# EasyEDA Pro project 酒精传感器实验.eprj

# Schematic Schematic1
Create Date: 2024-10-22; Page Name: P1; Project Name: 酒精传感器实验; Schematic Name: Schematic1; Update Date: 2024-10-22; Company: 嘉立创EDA; Page Size: A4; Version: V1.0
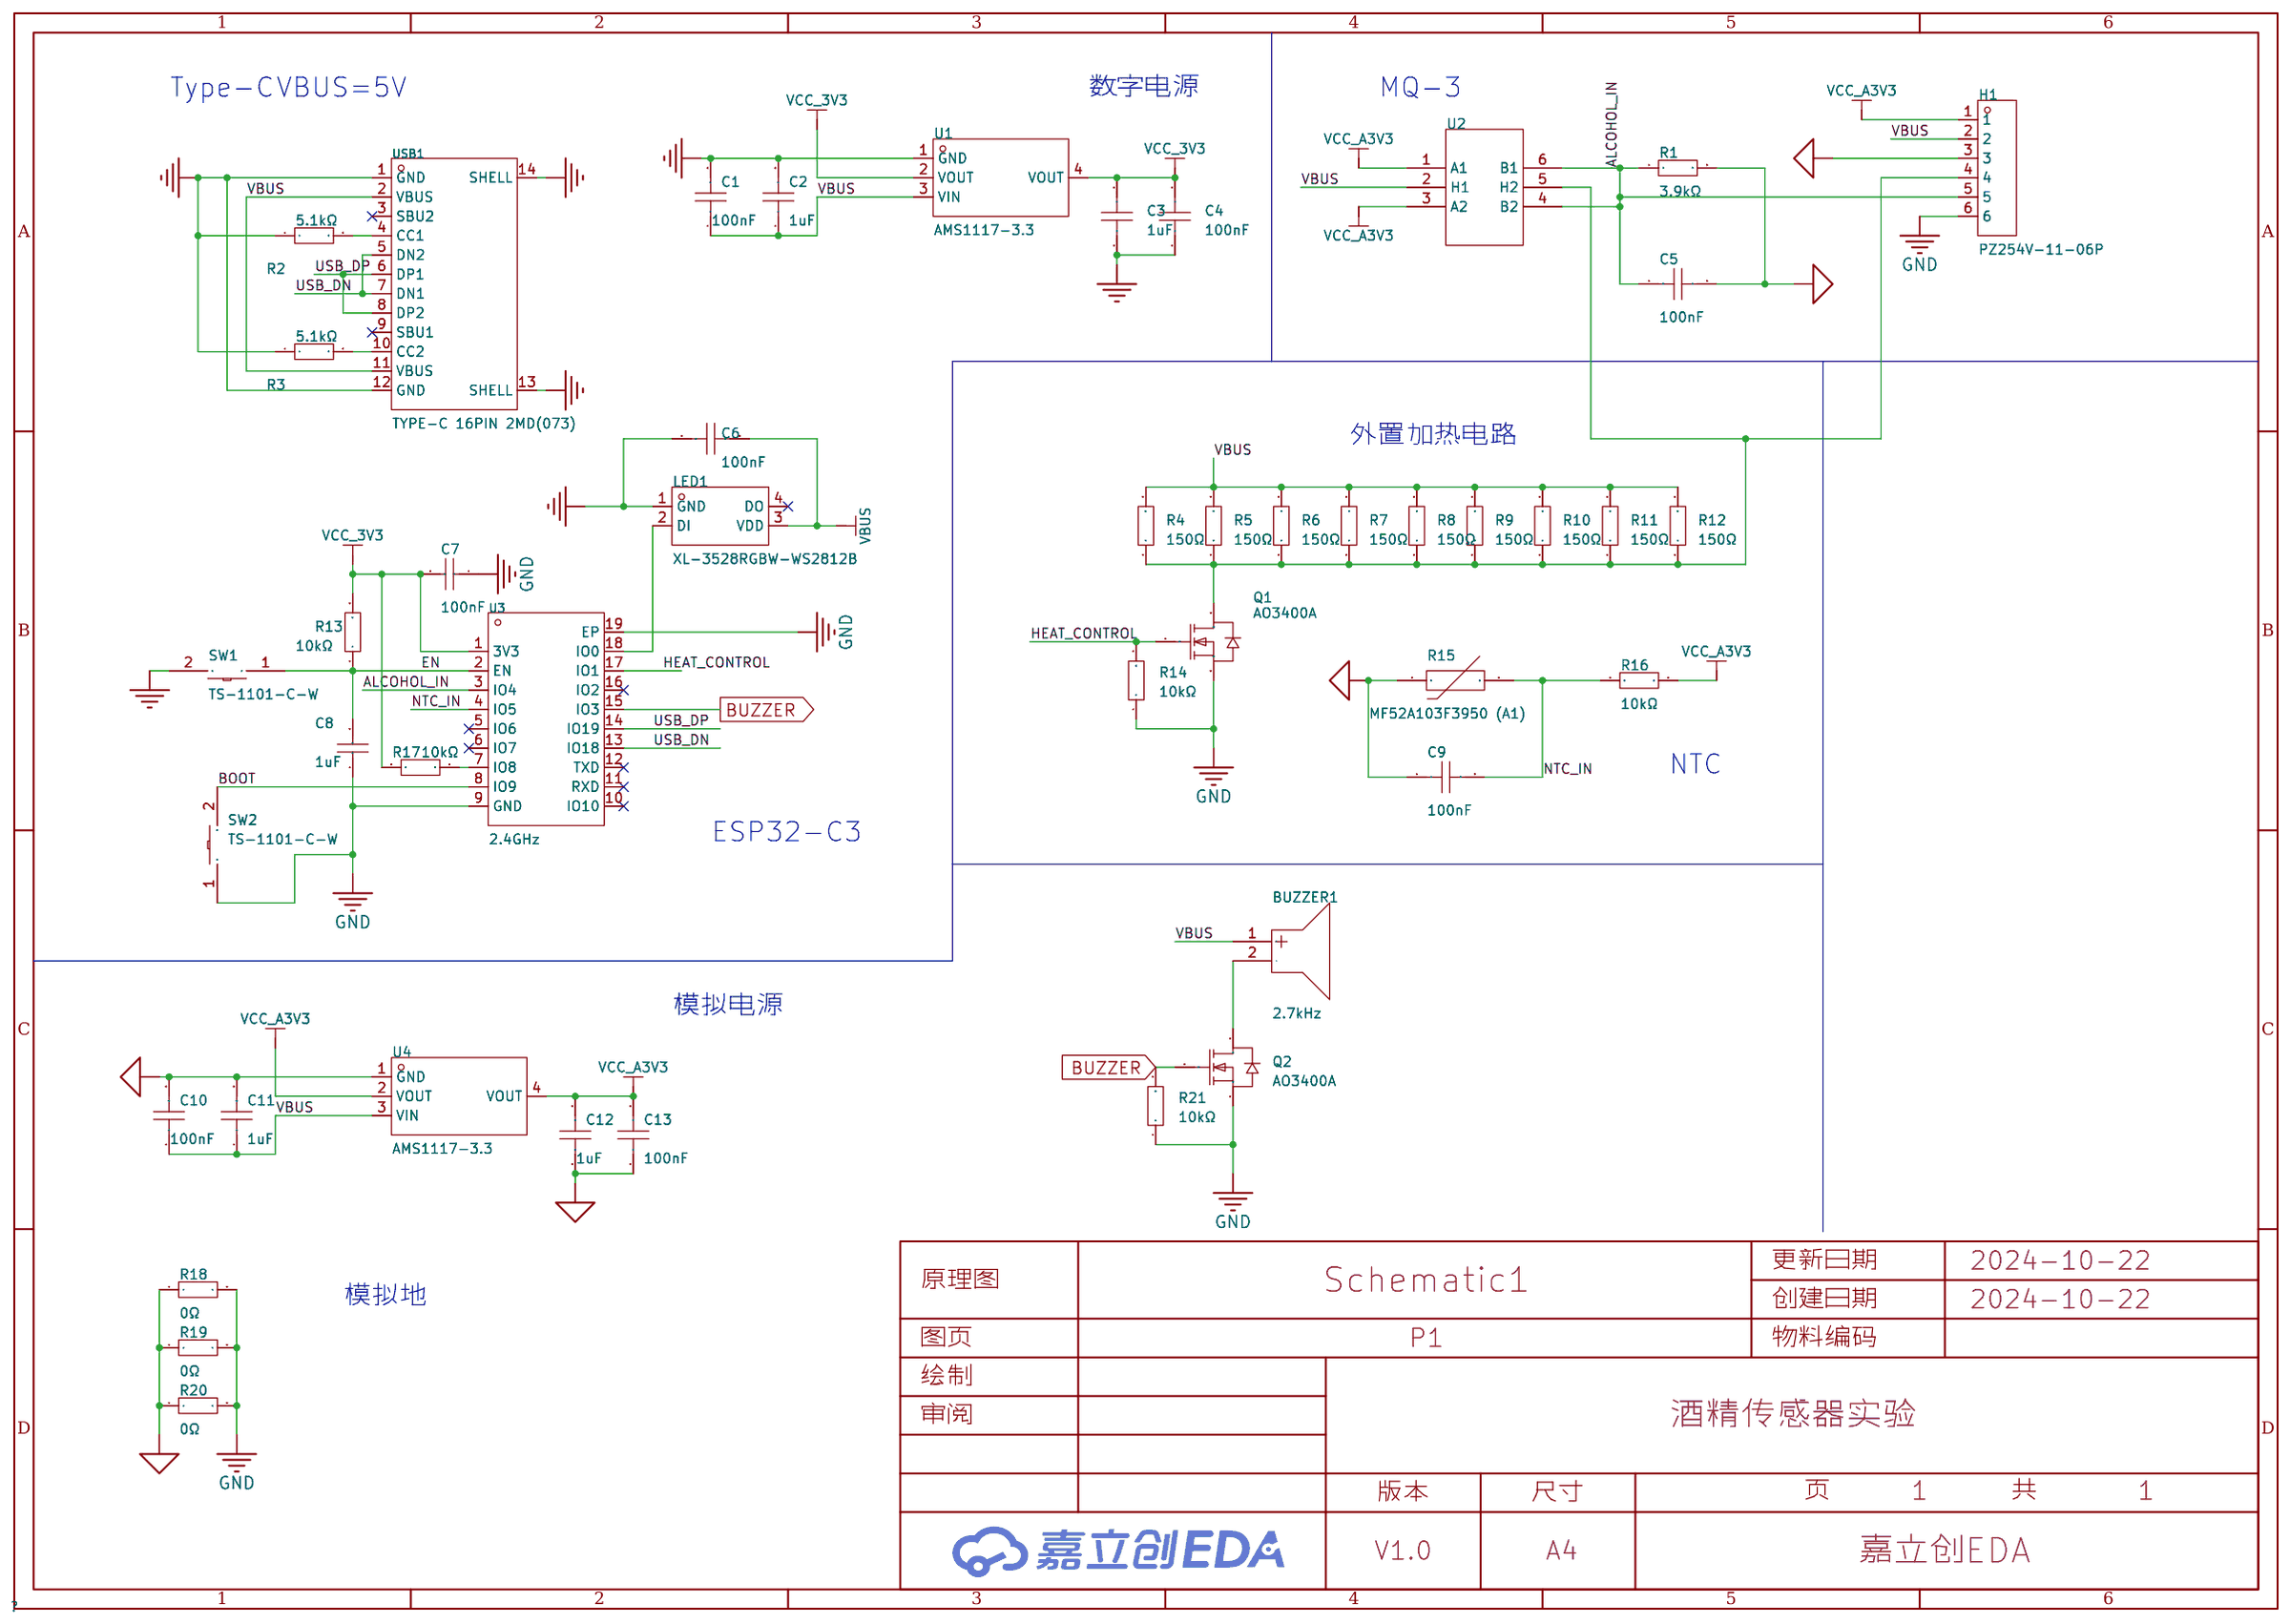
[diagram p0: schematic sheet]

## Parts
BUZZER1  2.7kHz  [BUZ-SMD_L9.6-W9.6-LS10.0-R]
C1  100nF  [C0603]
C2  1uF  [C0603]
C3  1uF  [C0603]
C4  100nF  [C0603]
C5  100nF  [C0603]
C6  100nF  [C0603]
C7  100nF  [C0603]
C8  1uF  [C0603]
C9  100nF  [C0603]
C10  100nF  [C0603]
C11  1uF  [C0603]
C12  1uF  [C0603]
C13  100nF  [C0603]
H1  PZ254V-11-06P  [HDR-TH_6P-P2.54-V-M]
LED1  XL-3528RGBW-WS2812B  [LED-SMD_4P-L3.5-W2.8-BR-1]
Q1  AO3400A  [SOT-23-3_L2.9-W1.3-P1.90-LS2.4-BR]
Q2  AO3400A  [SOT-23-3_L2.9-W1.3-P1.90-LS2.4-BR]
R1  3.9kΩ  [R0603]
R2  5.1kΩ  [R0603]
R3  5.1kΩ  [R0603]
R4  150Ω  [R0603]
R5  150Ω  [R0603]
R6  150Ω  [R0603]
R7  150Ω  [R0603]
R8  150Ω  [R0603]
R9  150Ω  [R0603]
R10  150Ω  [R0603]
R11  150Ω  [R0603]
R12  150Ω  [R0603]
R13  10kΩ  [R0603]
R14  10kΩ  [R0603]
R15  MF52A103F3950 (A1)  [RES-TH_L2.5-W2.5-P1.70-D0.3]
R16  10kΩ  [R0603]
R17  10kΩ  [R0603]
R18  0Ω  [R0603]
R19  0Ω  [R0603]
R20  0Ω  [R0603]
R21  10kΩ  [R0603]
SW1  TS-1101-C-W  [SW-SMD_L6.0-W3.3-LS8.0]
SW2  TS-1101-C-W  [SW-SMD_L6.0-W3.3-LS8.0]
U1  AMS1117-3.3  [SOT-223-3_L6.5-W3.4-P2.30-LS7.0-BR]
U2  -  [MQ-3-封装]
U3  2.4GHz  [BULETM-SMD_ESPRESSIF_ESP32-C3-WROOM-02-N4-4MB]
U4  AMS1117-3.3  [SOT-223-3_L6.5-W3.4-P2.30-LS7.0-BR]
USB1  TYPE-C 16PIN 2MD(073)  [USB-C-SMD_TYPE-C-6PIN-2MD-073]

## Library data of the parts
BUZZER1 = YS-SBZ9650DYB05: 驱动方式:有源(内含驱动线路);频率:2.7kHz;声压(SPL):80dB@5V,10cm;; LCSC Part Name: 贴片有源蜂鸣器5V; Supplier Part: C409830; Manufacturer: Fengming(锋鸣电子); Supplier Footprint: SMD,9.6x9.6mm; JLCPCB Part Class: 扩展库; Datasheet: https://atta.szlcsc.com/upload/public/pdf/source/20191217/C409830_8EC3C70066086F723D62F9967ED58A07.pdf; Supplier: LCSC; Oscillator Circuit: 有源(内含驱动线路); Operating Voltage: 3V~7V; Sound Pressure Level (SPL): 80dB@5V,10cm; Length: 9.6mm; Width: 9.6mm; Height: 5.3mm
C1 C4 C6 C7 C10 C13 = CC0603KRX7R9BB104: 容值:100nF;精度:±10%;额定电压:50V;材质(温度系数):X7R;; LCSC Part Name: 100nF ±10% 50V; Supplier Part: C14663; Manufacturer: YAGEO(国巨); Supplier Footprint: 0603; JLCPCB Part Class: Basic Part; Datasheet: https://atta.szlcsc.com/upload/public/pdf/source/20180910/C282072_33301C7F631E79921B82A8DAC6BCC5B3.pdf; Supplier: LCSC; Tolerance: ±10%; Voltage Rated: 50V; Temperature Coefficient: X7R
C2 C3 C11 C12 = CL10A105KB8NNNC: 容值:1uF;精度:±10%;额定电压:50V;材质(温度系数):X5R;; LCSC Part Name: 1uF ±10% 50V; Supplier Part: C15849; Manufacturer: SAMSUNG(三星); Supplier Footprint: 0603; JLCPCB Part Class: 基础库; Datasheet: https://atta.szlcsc.com/upload/public/pdf/source/20160218/1457707763339.pdf; Supplier: LCSC; Tolerance: ±10%; Voltage Rated: 50V; Temperature Coefficient: X5R
C5 C9 = CGA0603X7R104K500JT: 容值:100nF;精度:±10%;额定电压:50V;材质(温度系数):X7R;; LCSC Part Name: 100nF ±10% 50V; Supplier Part: C6119867; Manufacturer: HRE(芯声); Supplier Footprint: 0603; JLCPCB Part Class: 扩展库; Supplier: LCSC; Tolerance: ±10%; Voltage Rated: 50V; Temperature Coefficient: X7R
C8 = CL10A105KA8NNNC: 容值:1uF;精度:±10%;额定电压:25V;温度系数:X5R;; LCSC Part Name: 1uF±10%25V; Supplier Part: C5673; Manufacturer: SAMSUNG(三星); Supplier Footprint: 0603; JLCPCB Part Class: ExtendedPart; Datasheet: https://atta.szlcsc.com/upload/public/pdf/source/20160103/1457707739994.pdf; Supplier: LCSC; Tolerance: ±10%; Voltage Rated: 25V; Temperature Coefficient: X5R
H1 = PZ254V-11-06P: 插针结构:1x6P;间距:2.54mm;行距:-;圆针/方针:方针;安装类型:直插;排数:单排;总PIN位数:6P;额定电流:-;额定电压:-;配合针长度:6mm;塑高:2.5mm;端接针长度:3mm;触头材质:黄铜;触头镀层:-;工作温度范围:-40℃~+105℃;颜色:黑色;; LCSC Part Name: 间距:2.54mm 1x6P 直插 方针; Supplier Part: C492405; Manufacturer: XFCN(兴飞); Supplier Footprint: 插件,P=2.54mm; JLCPCB Part Class: 扩展库; Datasheet: https://atta.szlcsc.com/upload/public/pdf/source/20200309/C492405_597F1930F5B55CC3C7FD95458F1C3977.pdf; Supplier: LCSC; Pin Structure: 1x6P; Pitch: 2.54mm; Circluar Pins/Square Pins: 方针; Mounting Type: 直插; Number of Rows: 单排; Number of Pins: 6P; Length of Mating Pin: 6mm; Insulation Height: 2.5mm; Length of End Connection Pin: 3mm; Contact Material: 黄铜; Operating Temperature Range: -40℃~+105℃; Color: 黑色
LED1 = XL-3528RGBW-WS2812B: 3528 七彩幻彩雾状 ws2812B 内置驱动IC; Supplier Part: C2890364; Manufacturer: XINGLIGHT(成兴光); Supplier Footprint: SMD3528-4P; JLCPCB Part Class: 扩展库; Datasheet: https://atta.szlcsc.com/upload/public/pdf/source/20240218/041E1E0D0024617DFFF124D9C311BB4D.pdf; Supplier: LCSC
Q1 Q2 = AO3400A_C20917: 类型:1个N沟道;漏源电压(Vdss):30V;连续漏极电流(Id):5.7A;功率(Pd):1.4W;导通电阻(RDS(on)@Vgs,Id):26.5mΩ@10V,5.7A;阈值电压(Vgs(th)@Id):1.5V@250uA;; LCSC Part Name: 1个N沟道 耐压:30V 电流:5.7A; Supplier Part: C20917; Manufacturer: AOS; Supplier Footprint: SOT-23-3L; JLCPCB Part Class: 基础库; Datasheet: https://atta.szlcsc.com/upload/public/pdf/source/20140107/1457706668533.pdf; Supplier: LCSC; Type: 1个N沟道; Drain Source Voltage (Vdss): 30V; Continuous Drain Current (Id): 5.7A; Power Dissipation (Pd): 1.4W; Drain Source On Resistance (RDS(on)@Vgs,Id): 26.5mΩ@10V,5.7A; Gate Threshold Voltage (Vgs(th)@Id): 1.5V@250uA; Total Gate Charge (Qg@Vgs): 7nC@4.5V; Input Capacitance (Ciss@Vds): 630pF@15V; Operating Temperature: -55℃~+150℃@(Tj)
R1 = 0603WAF3901T5E: 电阻类型:厚膜电阻;阻值:3.9kΩ;精度:±1%;功率:100mW;最大工作电压:75V;温度系数:±100ppm/℃;; LCSC Part Name: 3.9kΩ ±1% 100mW 厚膜电阻; Supplier Part: C23018; Manufacturer: UNI-ROYAL(厚声); Supplier Footprint: 0603; JLCPCB Part Class: 基础库; Datasheet: https://atta.szlcsc.com/upload/public/pdf/source/20200306/C422600_1E6D84923E4A46A82E41ADD87F860B5C.pdf; Supplier: LCSC; Type: 厚膜电阻; Tolerance: ±1%; Power(Watts): 100mW; Overload Voltage (Max): 75V; Temperature Coefficient: ±100ppm/℃; Operating Temperature Range: -55℃~+155℃
R2 R3 = 0603WAF5101T5E: 电阻类型:厚膜电阻;阻值:5.1kΩ;精度:±1%;功率:100mW;; LCSC Part Name: 5.1kΩ ±1% 100mW; Supplier Part: C23186; Manufacturer: UNI-ROYAL(厚声); Supplier Footprint: 0603; JLCPCB Part Class: Basic Part; Datasheet: https://atta.szlcsc.com/upload/public/pdf/source/20200306/C422600_1E6D84923E4A46A82E41ADD87F860B5C.pdf; Supplier: LCSC; Type: 厚膜电阻; Tolerance: ±1%; Power(Watts): 100mW; Temperature Coefficient: ±100ppm/℃; Overload Voltage (Max): 75V; Operating Temperature Range: -55℃~+155℃
R4-R12 = 0603WAF1500T5E: 电阻类型:厚膜电阻;阻值:150Ω;精度:±1%;功率:100mW;温度系数:±100ppm/℃;; LCSC Part Name: 厚膜电阻 150Ω ±1% 100mW; Supplier Part: C22808; Manufacturer: UNI-ROYAL(厚声); Supplier Footprint: 0603; JLCPCB Part Class: 基础库; Datasheet: https://atta.szlcsc.com/upload/public/pdf/source/20200306/C422600_1E6D84923E4A46A82E41ADD87F860B5C.pdf; Supplier: LCSC; Type: 厚膜电阻; Tolerance: ±1%; Power(Watts): 100mW; Temperature Coefficient: ±100ppm/℃; Overload Voltage (Max): 75V; Operating Temperature Range: -55℃~+155℃
R13 R14 R16 R17 R21 = 0603WAF1002T5E: 电阻类型:厚膜电阻;阻值:10kΩ;精度:±1%;功率:100mW;; LCSC Part Name: 厚膜电阻 10kΩ ±1% 100mW; Supplier Part: C25804; Manufacturer: UNI-ROYAL(厚声); Supplier Footprint: 0603; JLCPCB Part Class: Basic Part; Datasheet: https://atta.szlcsc.com/upload/public/pdf/source/20200306/C422600_1E6D84923E4A46A82E41ADD87F860B5C.pdf; Supplier: LCSC; Type: 厚膜电阻; Tolerance: ±1%; Power(Watts): 100mW; Temperature Coefficient: ±100ppm/℃; Overload Voltage (Max): 75V; Operating Temperature Range: -55℃~+155℃
R15 = MF52A103F3950 (A1): 阻值(25℃):10kΩ;B值(25℃/50℃):3950K;电阻精度:±1%;功率:50mW;B值精度:±1%;最大稳态电流(25℃):-;; LCSC Part Name: 10kΩ 电阻精度:±1% 3950K; Supplier Part: C13879; Manufacturer: 时恒; Supplier Footprint: 插件,P=1.7mm; JLCPCB Part Class: 扩展库; Datasheet: https://atta.szlcsc.com/upload/public/pdf/source/20181018/C324070_6015F64EA824A635FDB9BBFA1E1FD5FE.pdf; Supplier: LCSC; Resistance @ 25℃: 10kΩ; B Constant (25℃/50℃): 3950K; Resistance Tolerance: ±1%; Power: 50mW; B Constant Tolerance: ±1%; Operating Temperature: -55℃~+125℃
R18-R20 = 0603WAF0000T5E: 电阻类型:厚膜电阻;阻值:0Ω;精度:±1%;功率:100mW;最大工作电压:75V;; LCSC Part Name: 0Ω ±1% 100mW 厚膜电阻; Supplier Part: C21189; Manufacturer: UNI-ROYAL(厚声); Supplier Footprint: 0603; JLCPCB Part Class: 基础库; Datasheet: https://atta.szlcsc.com/upload/public/pdf/source/20200306/C422600_1E6D84923E4A46A82E41ADD87F860B5C.pdf; Supplier: LCSC; Type: 厚膜电阻; Tolerance: ±1%; Power(Watts): 100mW; Overload Voltage (Max): 75V; Operating Temperature Range: -55℃~+155℃
SW1 SW2 = TS-1101-C-W: 触点电流:50mA;额定电压(AC):-;额定电压(DC):12V;额定功率:-;绝缘电阻:-;电路结构:单刀单掷;安装方式:立贴;带灯:无;作用力:260gf;机械寿命:5万次;带支架:否;; LCSC Part Name: 立贴 6*3.6*2.5mm 轻触开关 一型3*6*2.5有白ZD b拉伸白色带淡绿按键 卷装; Supplier Part: C318938; Manufacturer: XKB Connectivity(中国星坤); Supplier Footprint: SMD; JLCPCB Part Class: Extended Part; Datasheet: https://atta.szlcsc.com/upload/public/pdf/source/20200227/C318938_C2E53B1EEDE37D980A33616AC086DE53.pdf; Supplier: LCSC; Contact Current: 50mA; Voltage Rating (DC): 12V; Circuit: 单刀单掷; Mounting Style: 立贴; Actuator Style: 矩形按钮; Actuator/Cap Color: 白色带淡绿; With Lamp: 无; Operating Force: 260gf; Mechanical Life: 5万次; Operating Temperature: -30℃~+85℃; Switch Length: 6mm; Switch Width: 3.6mm; Switch Height: 2.5mm; Strike Gundam: 否
U1 U4 = AMS1117-3.3_C6186: 输出类型:固定;最大输入电压:-;输出电压:3.3V;最大输出电流:1A;电源纹波抑制比(PSRR):72dB@(120Hz);输出极性:正极;; LCSC Part Name: 输出3.3V 1A; Supplier Part: C6186; Manufacturer: AMS; Supplier Footprint: SOT-223; JLCPCB Part Class: 基础库; Datasheet: https://atta.szlcsc.com/upload/public/pdf/source/20180727/C6186_7A095716F0823C02F1997A905E26C086.pdf; Supplier: LCSC; Output Type: 固定; Output Voltage: 3.3V; MAX Output Current: 1A; Power Supply Rejection Ratio (PSRR): 72dB@(120Hz); Dropout Voltage: 1.3V@(800mA); Output Polarity: 正极; Number of Outputs: 1
U2 = MQ-3
U3 = ESP32-C3-WROOM-02-N4: 频率:2.4GHz;发射功率:20.5dBm;核心处理器:ESP32-C3;; Supplier Part: C2934560; Manufacturer: ESPRESSIF(乐鑫); Supplier Footprint: VFQFN-32-EP; JLCPCB Part Class: Extended Part; Datasheet: https://atta.szlcsc.com/upload/public/pdf/source/20220106/F07459EFFE1D7CBA94B4FB8A075146A6.pdf; Supplier: LCSC; Output Power: 20.5dBm; Core Processor: ESP32-C3; Support Interface: I2C；GPIO；SPI；JTAG；UART；USB；I2S
USB1 = TYPE-C 16PIN 2MD(073): 连接器类型:Type-C;标准:-;公母:母座;触点数量:16;端口数量:1;安装方式:卧贴;额定电流 - 电源:5A;工作温度范围:-25℃~+85℃;; LCSC Part Name: TYPE-C母座 16P 4脚插件带定位柱 不锈钢外壳 2次模顶; Supplier Part: C2765186; Manufacturer: SHOU HAN(首韩); Supplier Footprint: SMD; JLCPCB Part Class: 扩展库; Datasheet: https://atta.szlcsc.com/upload/public/pdf/source/20211123/39B17C16241EAC15C5E277BDA434118E.pdf; Supplier: LCSC; Connector Type: Type-C; Gender: 母座; Number of Ports: 1; Number of Contacts: 16; Mounting Style: 卧贴; Current Rating - Power (Max): 5A; Operating Temperature Range: -25℃~+85℃

## Nets
AGND: C5.2 C9.1 C10.2 C11.2 C12.1 C13.1 H1.3 R1.2 R15.1 R18.1 R19.1 R20.1 U4.1(GND)
GND: C1.2 C2.2 C3.1 C4.1 C6.2 C7.1 C8.1 H1.6 LED1.1(GND) Q1.2(S) Q2.2(S) R2.1 R3.1 R14.1 R18.2 R19.2 R20.2 R21.1 SW1.2 SW2.1 U1.1(GND) U3.9(GND) U3.19(EP) USB1.1(GND) USB1.12(GND) USB1.13(SHELL) USB1.14(SHELL)
VBUS: BUZZER1.1(+) C1.1 C2.1 C6.1 C10.1 C11.1 H1.2 LED1.3(VDD) R4.2 R5.2 R6.2 R7.2 R8.2 R9.2 R10.2 R11.2 R12.2 U1.3(VIN) U2.2(H1) U4.3(VIN) USB1.2(VBUS) USB1.11(VBUS)
VCC_3V3: C3.2 C4.2 C7.2 R13.2 R17.2 U1.2(VOUT) U1.4(VOUT) U3.1(3V3)
VCC_A3V3: C12.2 C13.2 H1.1 R16.2 U2.1(A1) U2.3(A2) U4.2(VOUT) U4.4(VOUT)
ALCOHOL_IN: C5.1 H1.5 R1.1 U2.4(B2) U2.6(B1) U3.3(IO4)
BOOT: SW2.2 U3.8(IO9)
BUZZER: Q2.1(G) R21.2 U3.15(IO3)
EN: C8.2 R13.1 SW1.1 U3.2(EN)
HEAT_CONTROL: Q1.1(G) R14.2 U3.17(IO1)
NTC_IN: C9.2 R15.2 R16.1 U3.4(IO5)
USB_DN: U3.13(IO18) USB1.5(DN2) USB1.7(DN1)
USB_DP: U3.14(IO19) USB1.6(DP1) USB1.8(DP2)
$1N514: R2.2 USB1.4(CC1)
$1N515: R3.2 USB1.10(CC2)
$1N1529: R17.1 U3.7(IO8)
$1N3224: LED1.2(DI) U3.18(IO0)
$1N5618: BUZZER1.2(-) Q2.3(D)
$1N8672: H1.4 Q1.3(D) R4.1 R5.1 R6.1 R7.1 R8.1 R9.1 R10.1 R11.1 R12.1 U2.5(H2)

Not connected (* = marked no-connect by the designer): LED1 4(DO)*; U3 5(IO6)* 6(IO7)* 10(IO10)* 11(RXD)* 12(TXD)* 16(IO2)*; USB1 3(SBU2)* 9(SBU1)*

## Notes on the sheet
- Type-C
- VBUS=5V
- 数字电源
- MQ-3
- 外置加热电路
- NTC
- ESP32-C3
- 模拟电源
- 模拟地

# Board PCB1
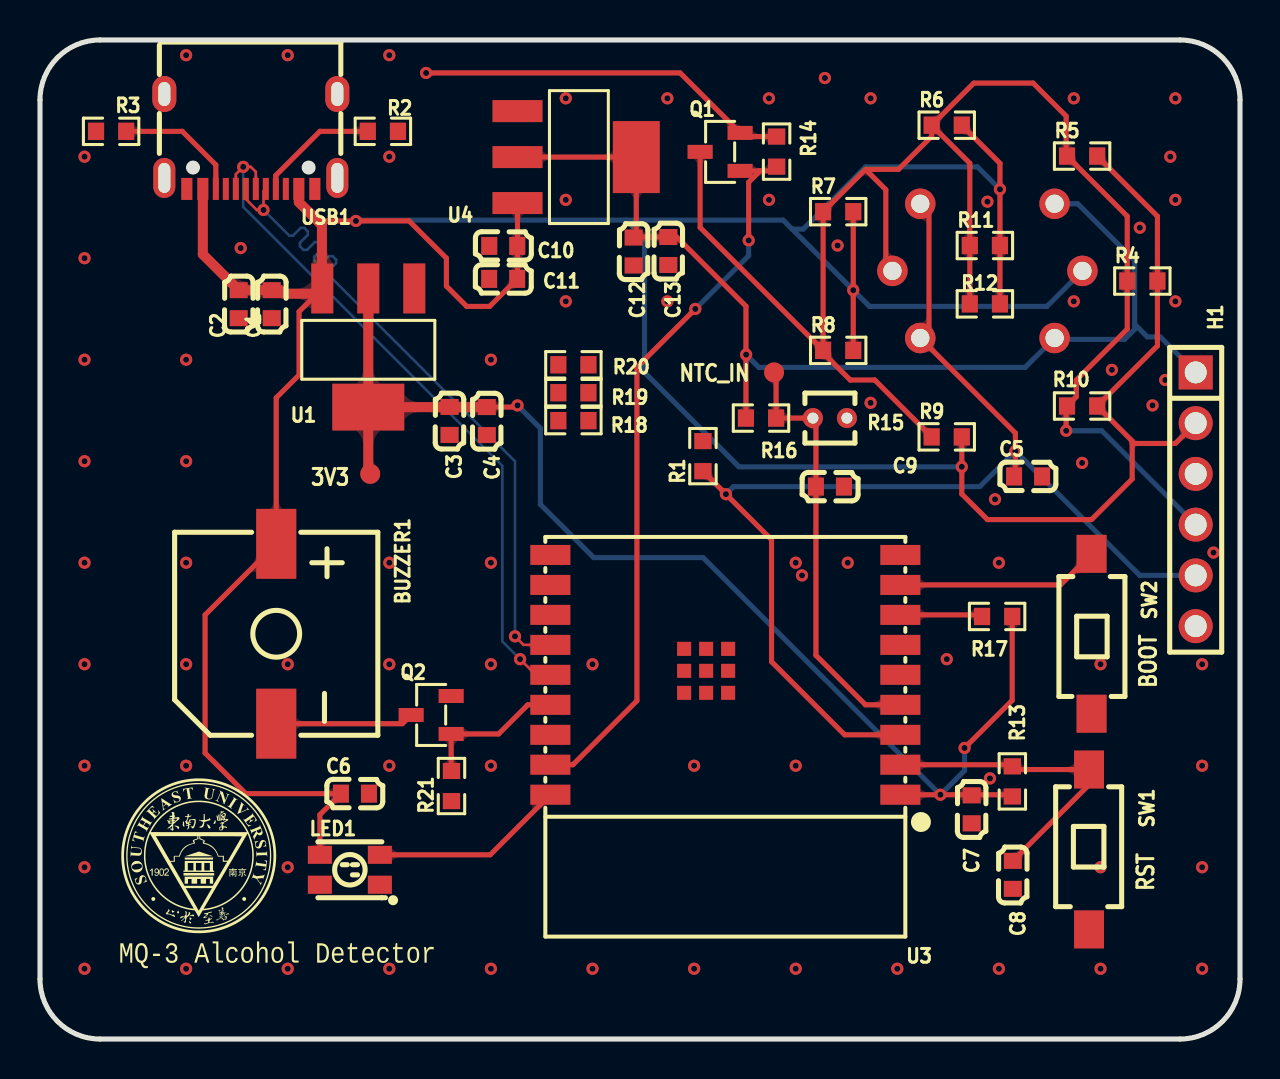
[diagram p1: board, top side]
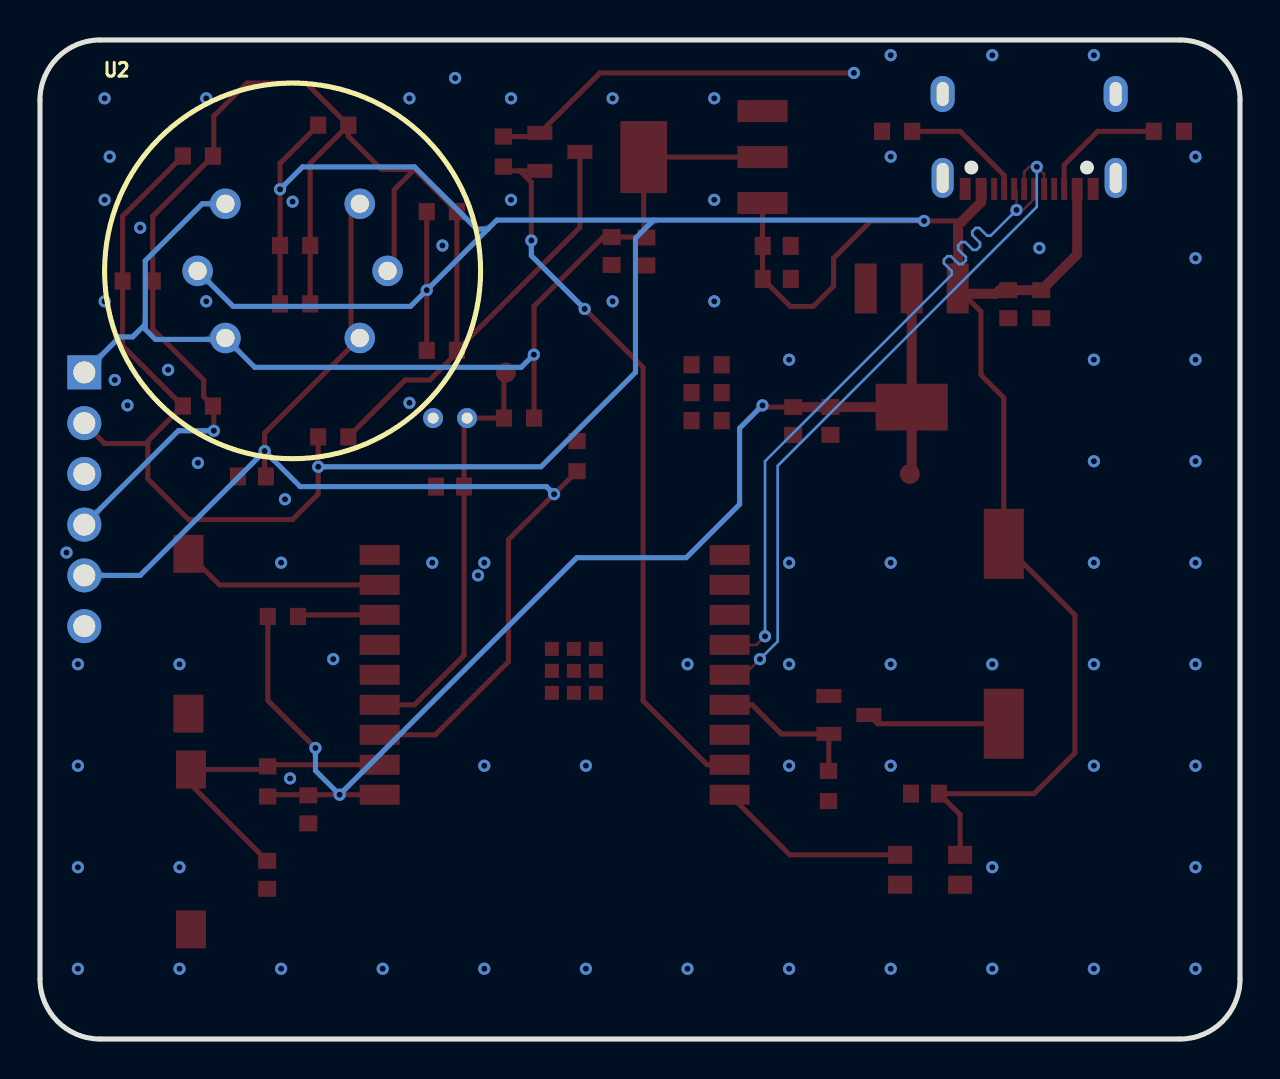
[diagram p2: board, bottom side, seen from below]

Outline 60 x 50 mm; copper layers: Top Layer, Bottom Layer. Coordinates in mm from the lower left corner of the outline.
Outline path: 0,47 0,3 arc(0.88,0.88) 3,0 57,0 arc(59.12,0.88) 60,3 60,47 arc(59.12,49.12) 57,50 3,50 arc(0.88,49.12) 0,47
Stack: Top Layer 0.035mm / Dielectric1 1.51mm FR4 er 4.5 / Bottom Layer 0.035mm

## Design rules (mm)
net USB_DN: DP1
net USB_DP: DP1
template: 自定义配置
spacing copperThickness1oz (default): track to track 0.102, other pairs 0.152 to 0.3
spacing copperThickness2oz: track to track 0.203, other pairs 0.152 to 0.3
track width copperThickness1oz (default): min 0.127, default 0.254, max 2.54
track width copperThickness2oz: min 0.203, default 0.254, max 2.54
differential pair differentialPair (default): width min 0.127, default 0.254, max 2.54; gap min 0.152, default 0.152
via viaSize (default): diameter min 0.5, default 0.61, max 10; hole min 0.3, default 0.305, max 6.3
net GND uses copperRegion1
net AGND uses copperRegion1

## Placement (name value [footprint] x y rotation side)
BUZZER1  2.7kHz  [BUZ-SMD_L9.6-W9.6-LS10.0-R]  11.81 20.28 90 top
C1  100nF  [C0603]  11.59 36.78 270 top
C2  1uF  [C0603]  9.94 36.78 270 top
C3  1uF  [C0603]  20.48 30.93 90 top
C4  100nF  [C0603]  22.34 30.93 90 top
C5  100nF  [C0603]  49.4 28.16 0 top
C6  100nF  [C0603]  15.75 12.28 0 top
C7  100nF  [C0603]  46.59 11.5 90 top
C8  1uF  [C0603]  48.64 8.22 90 top
C9  100nF  [C0603]  39.5 27.65 180 top
C10  100nF  [C0603]  23.16 39.69 180 top
C11  1uF  [C0603]  23.16 38.04 180 top
C12  1uF  [C0603]  29.68 39.41 90 top
C13  100nF  [C0603]  31.42 39.44 90 top
H1  PZ254V-11-06P  [HDR-TH_6P-P2.54-V-M]  57.78 27.01 270 top
LED1  XL-3528RGBW-WS2812B  [LED-SMD_4P-L3.5-W2.8-BR-1]  15.49 8.47 0 top
NOREF  -  [Pad_e50]  16.51 28.28 0 top
NOREF#2  -  [Pad_e53]  36.7 33.36 0 top
Q1  AO3400A  [SOT-23-3_L2.9-W1.3-P1.90-LS2.4-BR]  34.01 44.4 0 top
Q2  AO3400A  [SOT-23-3_L2.9-W1.3-P1.90-LS2.4-BR]  19.56 16.22 0 top
R1  3.9kΩ  [R0603]  33.15 29.17 90 top
R2  5.1kΩ  [R0603]  17.15 45.43 180 top
R3  5.1kΩ  [R0603]  3.56 45.43 0 top
R4  150Ω  [R0603]  55.12 37.93 0 top
R5  150Ω  [R0603]  52.1 44.19 0 top
R6  150Ω  [R0603]  45.34 45.73 0 top
R7  150Ω  [R0603]  39.91 41.41 0 top
R8  150Ω  [R0603]  39.91 34.46 0 top
R9  150Ω  [R0603]  45.34 30.14 0 top
R10  150Ω  [R0603]  52.1 31.68 0 top
R11  150Ω  [R0603]  47.24 39.71 0 top
R12  150Ω  [R0603]  47.24 36.79 0 top
R13  10kΩ  [R0603]  48.62 12.89 270 top
R14  10kΩ  [R0603]  36.83 44.41 270 top
R15  MF52A103F3950 (A1)  [RES-TH_L2.5-W2.5-P1.70-D0.3]  39.5 31.08 180 top
R16  10kΩ  [R0603]  36.05 31.08 180 top
R17  10kΩ  [R0603]  47.86 21.15 0 top
R18  0Ω  [R0603]  26.67 30.95 180 top
R19  0Ω  [R0603]  26.67 32.35 180 top
R20  0Ω  [R0603]  26.67 33.74 180 top
R21  10kΩ  [R0603]  20.57 12.66 90 top
SW1  TS-1101-C-W  [SW-SMD_L6.0-W3.3-LS8.0]  52.45 9.49 270 top
SW2  TS-1101-C-W  [SW-SMD_L6.0-W3.3-LS8.0]  52.58 20.28 90 top
U1  AMS1117-3.3  [SOT-223-3_L6.5-W3.4-P2.30-LS7.0-BR]  16.41 34.59 90 top
U2  -  [MQ-3-封装]  47.37 38.44 180 bottom
U3  2.4GHz  [BULETM-SMD_ESPRESSIF_ESP32-C3-WROOM-02-N4-4MB]  34.27 18.23 180 top
U4  AMS1117-3.3  [SOT-223-3_L6.5-W3.4-P2.30-LS7.0-BR]  26.84 44.14 180 top
USB1  TYPE-C 16PIN 2MD(073)  [USB-C-SMD_TYPE-C-6PIN-2MD-073]  10.54 44.92 180 top

## Footprints (pads in the part's own frame, mm; a bottom-side part is the same pattern mirrored in y, then rotated)
BULETM-SMD_ESPRESSIF_ESP32-C3-WROOM-02-N4-4MB
  rect 2x1 smd: 1(-8.75,6) 2(-8.75,4.5) 3(-8.75,3) 4(-8.75,1.5) 5(-8.75,0) 6(-8.75,-1.5) 7(-8.75,-3) 8(-8.75,-4.5) 9(-8.75,-6) 10(8.75,-6) 11(8.75,-4.5) 12(8.75,-3) 13(8.75,-1.5) 14(8.75,0) 15(8.75,1.5) 16(8.75,3) 17(8.75,4.5) 18(8.75,6)
  rect 0.7x0.7 smd: 19(-0.14,0.9) 19(-0.14,-0.2) 19(-0.14,-1.3) 19(0.96,0.9) 19(0.96,-0.2) 19(0.96,-1.3) 19(2.06,0.9) 19(2.06,-0.2) 19(2.06,-1.3)
BUZ-SMD_L9.6-W9.6-LS10.0-R
  rect 3.5x2 smd: 1(4.5,0) 2(-4.5,0)
C0603
  rect 0.8x0.9 smd: 1(-0.7,0) 2(0.7,0)
HDR-TH_6P-P2.54-V-M
  rect 1.7x1.7 hole 1.1: 1(-6.35,0)
  round 1.7 hole 1.1: 2(-3.81,0) 3(-1.27,0) 4(1.27,0) 5(3.81,0) 6(6.35,0)
LED-SMD_4P-L3.5-W2.8-BR-1
  rect 1.2x0.9 smd: 1(1.5,-0.75) 2(1.5,0.75) 3(-1.5,0.75) 4(-1.5,-0.75)
MQ-3-封装
  round 1.524 hole 0.914: 1(-3.359,3.359) 2(-4.75,0) 3(-3.359,-3.359) 4(3.359,-3.359) 5(4.75,0) 6(3.359,3.359)
Pad_e50
  round 1 smd: 1(0,0)
Pad_e53
  round 1 smd: 1(0,0)
R0603
  rect 0.806x0.864 smd: 1(-0.753,0) 2(0.753,0)
RES-TH_L2.5-W2.5-P1.70-D0.3
  round 1 hole 0.55: 1(-0.85,0) 2(0.85,0)
SOT-23-3_L2.9-W1.3-P1.90-LS2.4-BR
  rect 1.25x0.7 smd: 1(1,-0.95) 2(1,0.95) 3(-1,0)
SOT-223-3_L6.5-W3.4-P2.30-LS7.0-BR
  rect 2.5x1.1 smd: 1(2.97,-2.3) 2(2.97,0) 3(2.97,2.3)
  rect 2.34x3.6 smd: 4(-2.97,0)
SW-SMD_L6.0-W3.3-LS8.0
  rect 1.9x1.5 smd: 1(-4,0) 2(4,0)
USB-C-SMD_TYPE-C-6PIN-2MD-073
  rect 0.55x1.1 smd: 1(-3.2,2.375) 2(-2.4,2.375) 11(2.4,2.375) 12(3.2,2.375)
  rect 0.3x1.1 smd: 3(-1.75,2.375) 4(-1.25,2.375) 5(-0.75,2.375) 6(-0.25,2.375) 7(0.25,2.375) 8(0.75,2.375) 9(1.25,2.375) 10(1.75,2.375)
  oval 1.1x2 hole 0.6x1.5: 13(-4.325,1.825) 14(4.325,1.825)
  oval 1.2x1.8 hole 0.6x1.2: 13(-4.325,-2.375) 14(4.325,-2.375)

## Nets
As in the schematic, except:
VCC_3V3: C3.2 C4.2 C7.2 NOREF.1 R13.2 R17.2 U1.2 U1.4 U3.1
NTC_IN: C9.2 NOREF#2.1 R15.2 R16.1 U3.4

Pads without a net: LED1 4; U3 5 6 10 11 12 16; USB1 3 9

## Via types
v1: diameter 0.61, hole 0.304, Top Layer to Bottom Layer, 64 vias
v2: diameter 0.61, hole 0.305, Top Layer to Bottom Layer, 32 vias

## Routing (per net, layer and track width the routed paths; a pad name or vN(x,y) marks a point on that pad's centre or on a via; arc(x,y) is an arc through that point)
AGND:
  vias: v1(26.29,47.08) v1(26.29,42) v1(26.29,36.92) v1(31.37,47.08) v1(31.37,36.92) v1(36.45,47.08) v1(36.45,42) v1(41.53,47.08) v1(41.53,31.84) v1(51.69,47.08) v1(51.69,36.92) v1(55.63,31.71) v1(56.77,47.08) v1(56.77,42) v1(56.77,36.92) v2(39.24,48.09) v2(39.88,39.71) v2(47.37,41.91) v2(47.75,27.01) v2(52.1,28.83) v2(53.59,33.49) v2(54.99,40.6) v2(56.26,32.98) v2(56.52,44.16)
GND: length 18.8
  Top Layer w0.254: v2(19.3,48.35) 32.01,48.35 Q1.2 35.19,45.17 R14.1
  vias: v1(2.23,44.16) v1(2.23,39.08) v1(2.23,34) v1(2.23,28.92) v1(2.23,23.84) v1(2.23,18.76) v1(2.23,13.68) v1(2.23,8.6) v1(2.23,3.52) v1(7.31,49.24) v1(7.31,34) v1(7.31,28.92) v1(7.31,23.84) v1(7.31,18.76) v1(7.31,13.68) v1(7.31,3.52) v1(12.39,49.24) v1(12.39,18.76) v1(12.39,8.6) v1(12.39,3.52) v1(17.47,49.24) v1(17.47,44.16) v1(17.47,23.84) v1(17.47,18.76) v1(17.47,13.68) v1(17.47,3.52) v1(22.55,34) v1(22.55,23.84) v1(22.55,18.76) v1(22.55,13.68) v1(22.55,3.52) v1(27.63,18.76) v1(27.63,3.52) v1(32.71,13.68) v1(32.71,3.52) v1(37.79,23.84) v1(37.79,13.68) v1(37.79,3.52) v1(42.87,3.52) v1(47.95,23.84) v1(47.95,3.52) v1(53.03,18.76) v1(53.03,8.6) v1(53.03,3.52) v1(58.11,18.76) v1(58.11,13.68) v1(58.11,8.6) v1(58.11,3.52) v1(58.67,24.35) v2(10.03,39.59) v2(38.1,23.2) v2(40.39,23.84) v2(45.34,19.01) v2(47.5,13.04)
VBUS: length 198.2
  Top Layer w0.254: R7.2 v2(40.66,37.48) R8.2 ; 13.88,40.94 v2(15.8,40.94) 18.46,40.94 20.32,39.08 20.32,37.68 21.34,36.66 22.48,36.66 C11.1 23.88,38.06 U4.3 ; H1.2 56.77,29.81 54.61,29.81 ; LED1.3 13.99,11.23 C6.1 10.29,12.28 8.26,14.31 8.26,21.23 BUZZER1.1 11.81,32.09 12.95,33.24 12.95,36.4 13.85,37.3 ; R5.2 55.87,41.18 R4.2 55.87,34.69 R10.2 54.61,29.93 54.61,29.81 ; R12.2 R11.2 v2(48,42.53) 48,43.83 R6.2 ; R9.2 v2(46.09,28.64) 46.09,27.28 47.37,26 52.58,26 54.61,28.03 54.61,29.81
  Top Layer w0.5: 8.14,42.54 8.14,39.27 C2.1 12.02,37.48 12.19,37.3 13.85,37.3 U1.3 14.1,37.58 14.1,40.73 12.94,41.88 USB1.2
  Bottom Layer w0.254: v2(46.09,28.64) 34.95,28.64 30.23,33.36 30.23,40.07 29.32,40.98 ; 29.32,40.98 15.88,40.98 ; 29.32,40.98 37.16,40.98 37.6,40.54 ; 37.6,40.54 v2(40.66,37.48) 41.48,36.66 50.34,36.66 U2.2 ; 37.6,40.54 38.16,40.54 41.28,43.65 46.87,43.65 v2(48,42.53)
VCC_3V3: length 64.3
  Top Layer w0.254: C4.2 23.79,31.63 v2(23.88,31.71) ; R17.2 48.61,16.95 v2(46.23,14.57) ; R13.2 48.53,12.23 v2(45.02,12.23) U3.1
  Top Layer w0.5: U1.4 16.41,28.38 NOREF.1 ; U1.4 22.34,31.62 C4.2 ; U1.4 U1.2
  Bottom Layer w0.254: v2(23.88,31.71) 25.02,30.57 25.02,26.76 27.69,24.09 33.16,24.09 v2(45.02,12.23) 46.23,13.43 v2(46.23,14.57)
VCC_A3V3: length 55.8
  Top Layer w0.254: 29.71,40.14 C12.2 ; 29.71,40.14 C13.2 31.83,40.14 35.3,36.67 R16.2 ; 29.71,40.14 29.81,40.25 U4.4 U4.2
  Bottom Layer w0.254: 54.74,35.77 54.74,38.95 51.89,41.8 U2.1 ; 54.74,35.77 54.74,35.52 54.23,35.01 50.8,35.01 U2.3 49.26,33.62 35.94,33.62 v2(35.31,34.25) ; 54.74,35.77 55.37,35.14 56.01,35.14 H1.1
ALCOHOL_IN: length 61.9
  Top Layer w0.254: C5.1 48.77,28.22 v2(48.77,29.43) 48.77,30.33 U2.4 44.45,35.52 44.45,41.36 U2.6 ; R1.1 v2(34.3,27.27) 36.58,24.99 36.58,18.88 40.23,15.23 U3.3
  Bottom Layer w0.254: v2(34.3,27.27) 34.68,27.65 46.99,27.65 v2(48.77,29.43) 54.99,23.2 H1.5
BOOT: length 10.2
  Top Layer w0.254: SW2.2 51.02,22.73 U3.8
BUZZER: length 7.4
  Top Layer w0.254: U3.15 24.39,16.73 22.93,15.27 Q2.1 20.56,13.43 R21.2
EN: length 15.7
  Top Layer w0.254: U3.2 48.54,13.73 R13.1 48.78,13.49 SW1.1 52.45,12.73 C8.2
HEAT_CONTROL: length 36.6
  Top Layer w0.254: 36,43.45 Q1.1 ; 36,43.45 36.62,43.45 R14.2 ; 36,43.45 35.43,42.88 v2(35.43,39.97) ; v2(32.77,36.54) 29.84,33.62 29.84,16.93 26.64,13.73 U3.17
  Bottom Layer w0.254: v2(35.43,39.97) 35.43,39.2 v2(32.77,36.54)
NTC_IN: length 21.4
  Top Layer w0.254: NOREF#2.1 36.8,33.26 R16.1 R15.2 38.8,30.93 C9.2 38.8,19.2 41.27,16.73 U3.4
USB_DN: length 35.2
  Top Layer w0.127: USB1.7 10.29,42.04 10.84,41.49 v2(11.18,41.49) 11.18,42.43 USB1.5 ; v2(23.75,20.15) 24.18,19.73 U3.13
  Bottom Layer w0.127: v2(23.75,20.15) 23.75,28.92 14.41,38.25 14.41,38.43 14.8,38.83 14.8,39.01 14.63,39.18 14.45,39.18 14.06,38.79 13.88,38.79 13.71,38.96 13.71,39.14 14.1,39.53 14.1,39.71 13.92,39.89 13.74,39.89 13.35,39.49 13.17,39.49 13,39.67 13,39.85 13.39,40.24 13.39,40.42 13.22,40.59 13.04,40.59 12.65,40.2 12.47,40.2 v2(11.18,41.49)
USB_DP: length 35.1
  Top Layer w0.127: USB1.6 10.79,43.4 10.54,43.65 v2(10.16,43.65) 9.79,43.28 USB1.8 ; U3.14 24.79,18.23 v2(24,19.01)
  Bottom Layer w0.127: v2(10.16,43.65) 10.16,41.64 23.11,28.69 23.11,19.9 v2(24,19.01)
$1N514: length 6.2
  Top Layer w0.254: R2.2 14,45.43 11.79,43.22 USB1.4
$1N515: length 6.4
  Top Layer w0.254: R3.2 7.11,45.43 8.79,43.75 USB1.10
$1N1529: length 4.1
  Top Layer w0.254: R17.1 47.02,21.23 U3.7
$1N3224: length 9.8
  Top Layer w0.254: LED1.2 22.51,9.22 U3.18
$1N5618: length 6.9
  Top Layer w0.254: BUZZER1.2 18.12,15.78 Q2.3
$1N8672: length 84.6
  Top Layer w0.254: R6.1 44.58,45.18 42.93,43.52 41.27,43.52 ; R6.1 46.49,43.83 R11.1 R12.1 ; R6.1 46.69,47.84 49.66,47.84 51.31,46.19 51.31,44.23 R5.1 54.36,41.18 R4.1 54.36,35.53 51.82,32.98 51.82,32.14 R10.1 51.31,31.64 v2(51.31,30.44) ; R9.1 41.74,32.98 40.51,32.98 39.16,34.34 R8.1 ; R8.1 R7.1 41.27,43.52 ; R8.1 33.01,40.61 Q1.3 ; 41.27,43.52 42.29,42.5 42.29,38.77 U2.5
  Bottom Layer w0.254: v2(51.31,30.44) 53.09,30.44 H1.4

## Copper pours and planes (outline as drawn; the poured copper is in the pictures)
AGND on Top Layer: 21.21,47.97 21.21,38.32 23.24,36.28 26.03,36.28 27.05,35.27 27.05,28.66 28.96,26.76 58.8,26.76 60.96,28.92 60.96,49.75 57.91,52.79 26.03,52.79
AGND on Bottom Layer: 21.21,47.97 21.21,38.32 22.99,36.54 25.91,36.54 27.05,35.39 27.05,28.66 28.96,26.76 58.8,26.76 60.96,28.92 60.96,49.75 57.91,52.79 26.03,52.79
GND on Top Layer: 0.76,52.54 15.88,52.54 20.45,47.97 20.45,37.93 22.73,35.65 25.76,35.65 26.29,35.12 26.29,28.16 28.19,26.25 58.29,26.25 60.71,23.84 60.71,0.98 58.17,-1.56 1.71,-1.56 -2.85,3 -2.85,48.92
GND on Bottom Layer: 0.76,52.54 15.88,52.54 20.45,47.97 20.45,37.93 22.73,35.65 25.76,35.65 26.29,35.12 26.29,28.16 28.19,26.25 58.29,26.25 60.71,23.84 60.71,0.98 58.17,-1.56 1.71,-1.56 -2.85,3 -2.85,48.92

Small or netless copper shapes (teardrops, artwork), in the pictures only: 153 on Top Layer, 30 on Bottom Layer

## Text on the board
Top Silkscreen Layer: 3V3 | NTC_IN | RST | BOOT | MQ-3 Alcohol Detector
